# EAGLE design radio_am_4bjt (EAGLE 9.6.2)
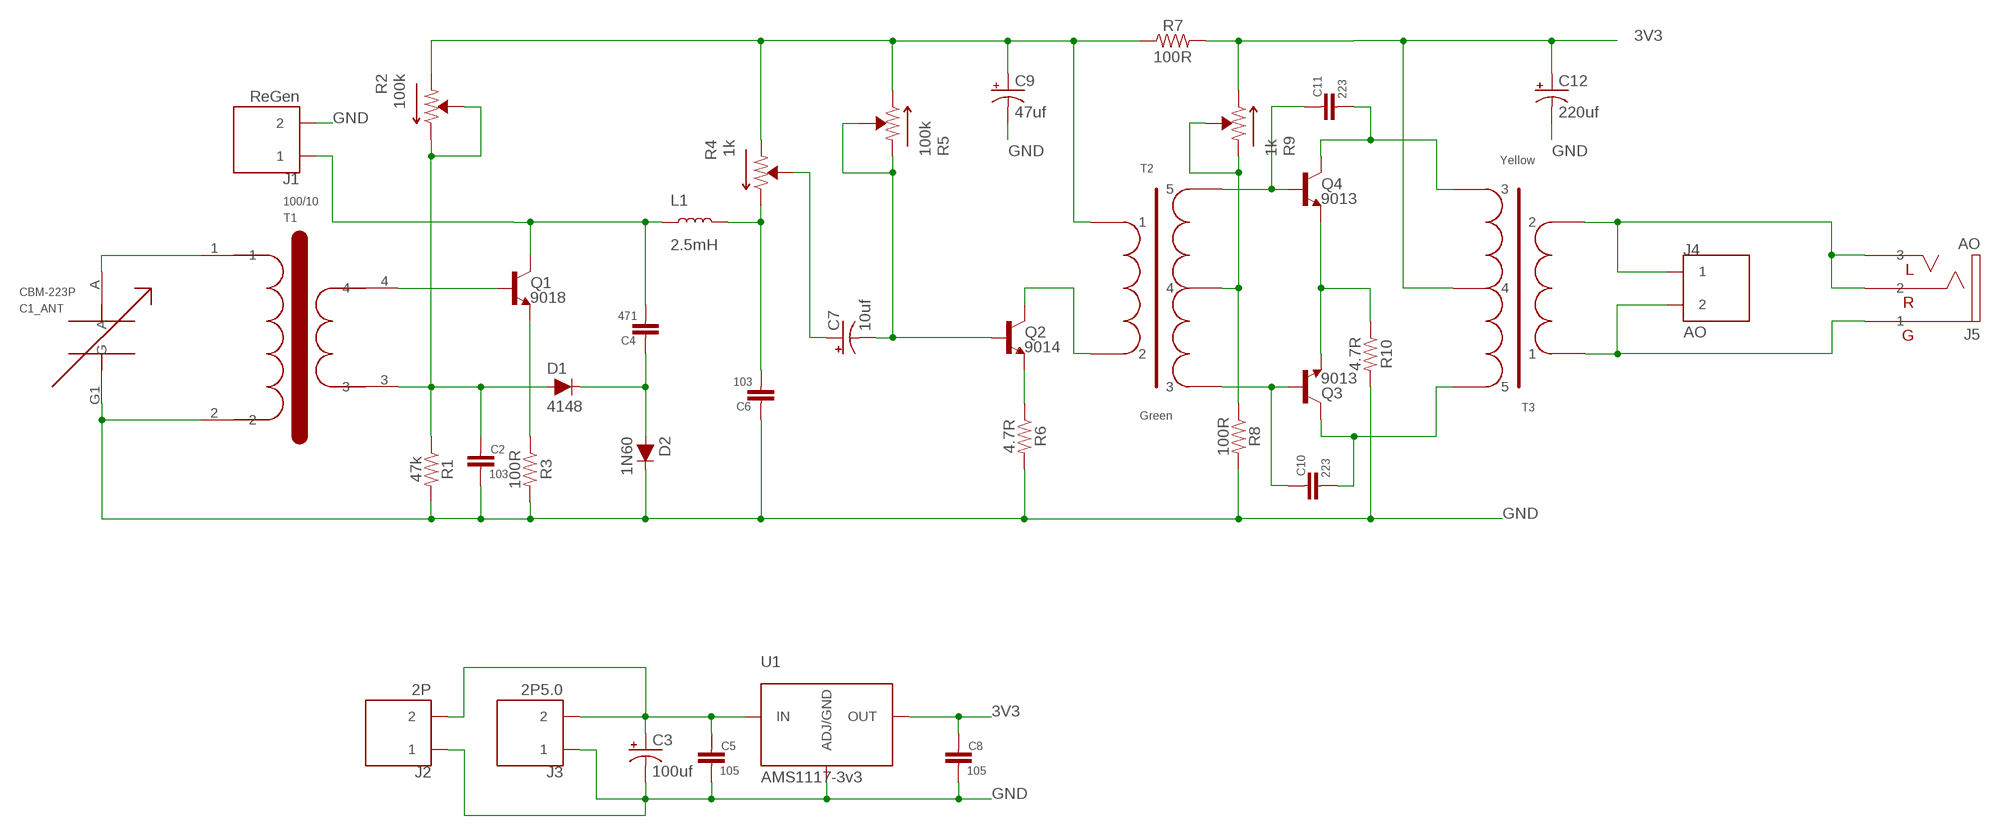
[diagram p0: schematic, sheet 1]

## Parts
C1  CBM-223P  [CBM-223P]
C2  103  CAP_P  [CAP_5MM]
C3  100uf  CAP  [CAP_2.5MM]
C4  471  CAP_P  [CAP_5MM]
C5  105  CAP_P  [CAP_5MM]
C6  103  CAP_P  [CAP_5MM]
C7  10uf  CAP2MM  [CAP_2MM]
C8  105  CAP_P  [CAP_5MM]
C9  47uf  CAP2MM  [CAP_2MM]
C10  223  CAP_P  [CAP_5MM]
C11  223  CAP_P  [CAP_5MM]
C12  220uf  CAP  [CAP_2.5MM]
D1  4148  DIODE-1N4148  [DIODE-1N4148]
D2  1N60  DIODE-1N4148  [DIODE-1N4148]
J1  ReGen  2P  [2P_2.54MM]
J2  2P  [2P_2.54MM]
J3  2P5.0  [2P_5.08MM]
J4  AO  2P5.0  [2P_5.08MM]
J5  AO  3.5MM_PHONE  [3.5MM]
L1  2.5mH  INDUCTOR_PTH  [VLU0810]
Q1  9018  TRANS_NPN-2N3904  [TO-92]
Q2  9014  TRANS_NPN-2N3904  [TO-92]
Q3  9013  TRANS_NPN-2N3904  [TO-92]
Q4  9013  TRANS_NPN-2N3904  [TO-92]
R1  47k  RESISTORAXIAL-0.3  [AXIAL-0.3]
R2  100k  RES_ADJ  [3362P]
R3  100R  RESISTORAXIAL-0.3  [AXIAL-0.3]
R4  1k  RES_ADJ  [3362P]
R5  100k  RES_ADJ  [3362P]
R6  4.7R  RESISTORAXIAL-0.3  [AXIAL-0.3]
R7  100R  RESISTORAXIAL-0.3  [AXIAL-0.3]
R8  100R  RESISTORAXIAL-0.3  [AXIAL-0.3]
R9  1k  RES_ADJ  [3362P]
R10  4.7R  RESISTORAXIAL-0.3  [AXIAL-0.3]
T1  100/10  AM_ANT_COIL  [AM_ANT_COIL]
T2  Green  TRANSFORMER_BJT_PP  [TRANSFORMER_BJT_PP_2_4]
T3  Yellow  TRANSFORMER_BJT_PP  [TRANSFORMER_BJT_PP_2_4]
U1  AMS1117-3v3  AMS1117  [SOT-223]

## Nets
3V3: C8.P$1 C12.+ R7.P$2 R9.P$3 T3.4 U1.2(OUT) U1.4(OUT)
GND: C1.G1(G) C2.P$2 C3.- C5.P$2 C6.P$1 C8.P$2 C9.- C12.- D2.C J1.2 J2.1 J3.L R1.P$2 R3.P$2 R6.P$2 R8.P$2 R10.P$2 T1.2 U1.1(ADJ/GND)
N$1: C1.A T1.1
N$2: Q1.2(B) T1.4
N$3: Q2.1(E) R6.P$1
N$4: C4.P$1 D1.C D2.A
N$5: C4.P$2 J1.1 L1.+ Q1.3(C)
N$6: C7.+ R4.P$2
N$7: C9.+ R2.P$1 R4.P$1 R5.P$3 R7.P$1 T2.1
N$8: C6.P$2 L1.- R4.P$3
N$9: C7.- Q2.2(B) R5.P$1 R5.P$2
N$11: C11.P$2 Q4.3(C) T3.3
N$12: C10.P$2 Q3.3(C) T3.5
N$13: R8.P$1 R9.P$1 R9.P$2 T2.4
N$14: C10.P$1 Q3.2(B) T2.3
N$15: C11.P$1 Q4.2(B) T2.5
N$16: J4.N J5.P$1 T3.1
N$17: J4.L J5.P$2 J5.P$3 T3.2
N$18: C2.P$1 D1.A R1.P$1 R2.P$2 R2.P$3 T1.3
N$19: C3.+ C5.P$1 J2.2 J3.N U1.3(IN)
N$20: Q3.1(E) Q4.1(E) R10.P$1
N$21: Q1.1(E) R3.P$1
N$22: Q2.3(C) T2.2
Unconnected: C1.G2(G) C1.O

## Library data of the parts
C1 = RF:CBM-223P
C2 C4-C6 C8 C10 C11 = Capacitors:CAP_P
C3 C7 C9 C12 = Capacitors:CAP
D1 D2 = PTH:DIODE: Diode These are standard reverse protection diodes and small signal diodes. SparkFun Products: SparkFun SparkPunk Sound Kit <https://www.sparkfun.com/products/11177> SparkFun ESP8266 Thing <https://www.sparkfun.com/products/13231>; PROD_ID: DIO-08378; VALUE: 200mA/100V/1V
J1-J4 = Jumpers:2P
J5 = Connectors:3.5MM_PHONE: 描述： 类型：3.5mm耳机插口 接口：三段式 连接：https://item.szlcsc.com/19296.html
L1 = Coils:INDUCTOR_PTH: 描述： 名称：电感 VLU0810-102K 参数：1000uH ±10% 封装：8*10 链接：https://item.szlcsc.com/73738.html
Q1-Q4 = PTH:TRANS_NPN: NPN transistor Current controlled devices typically used to amplify current or used as a switch. BC547 - COM-08928 <http://www.sparkfun.com/products/8928> (TO-92 45V 100mA) (1.Collector 2.Base 3.Emitter) 2N3904 - COM-00521 <http://www.sparkfun.com/products/521> (TO-92 40V 200mA) (1.Emitter 2.Base 3.Collector) P2N2222A - COM-12852 <http://www.sparkfun.com/products/12852> (TO-92 40V 600mA) (1.Collector 2.Base 3.Emitter); PROD_ID: TRANS-08447; VALUE: 200mA/40V
R1 R3 R6-R8 R10 = PTH:RESISTOR: Generic Resistor Package
R2 R4 R5 R9 = Resistors:RES_ADJ: 描述：可调电阻器 链接：https://item.szlcsc.com/120225.html
T1 = RF:AM_ANT_COIL
T2 T3 = Coils:TRANSFORMER_BJT_PP
U1 = IC_Power:AMS1117

## Board
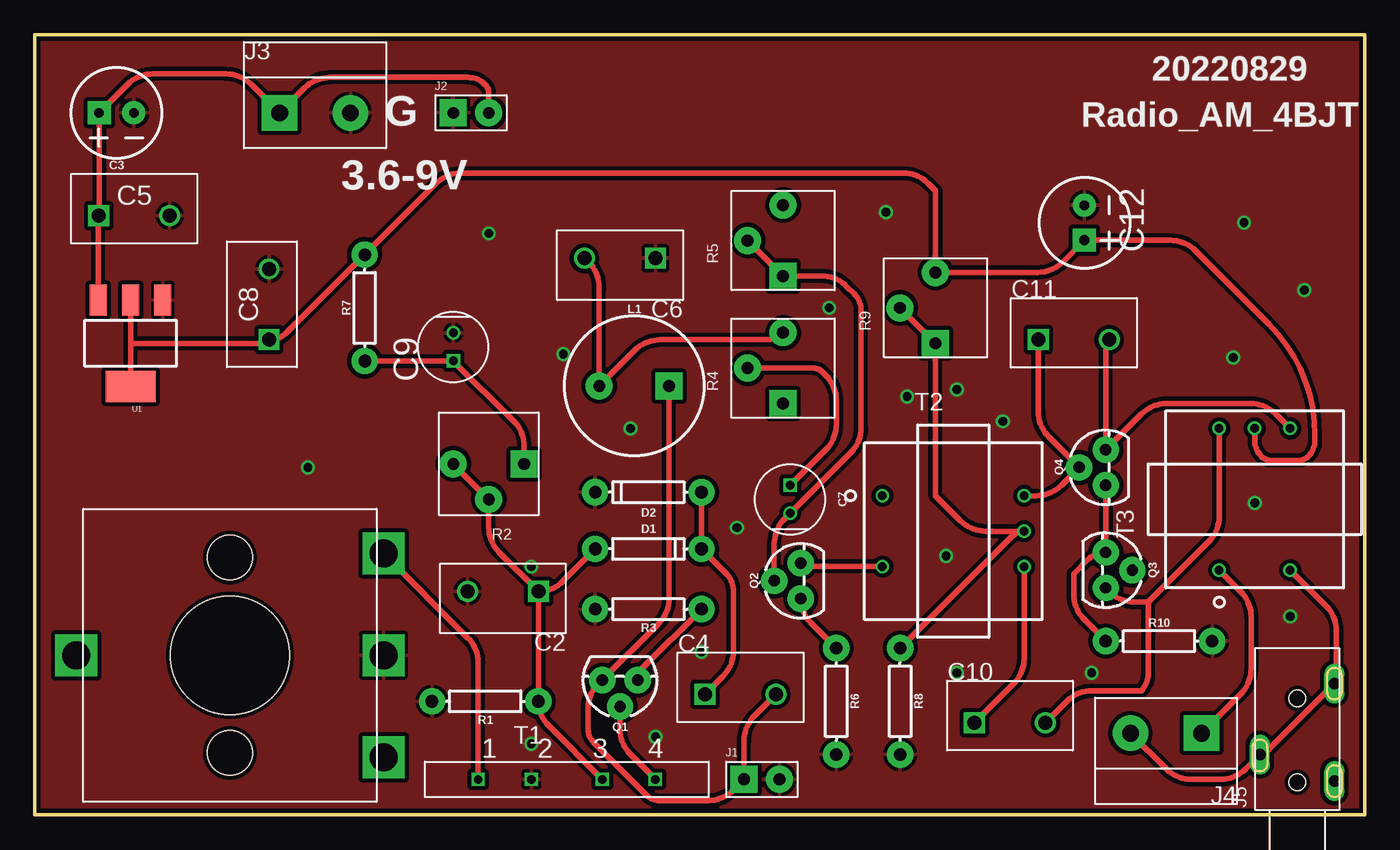
[diagram p1: board, top side]
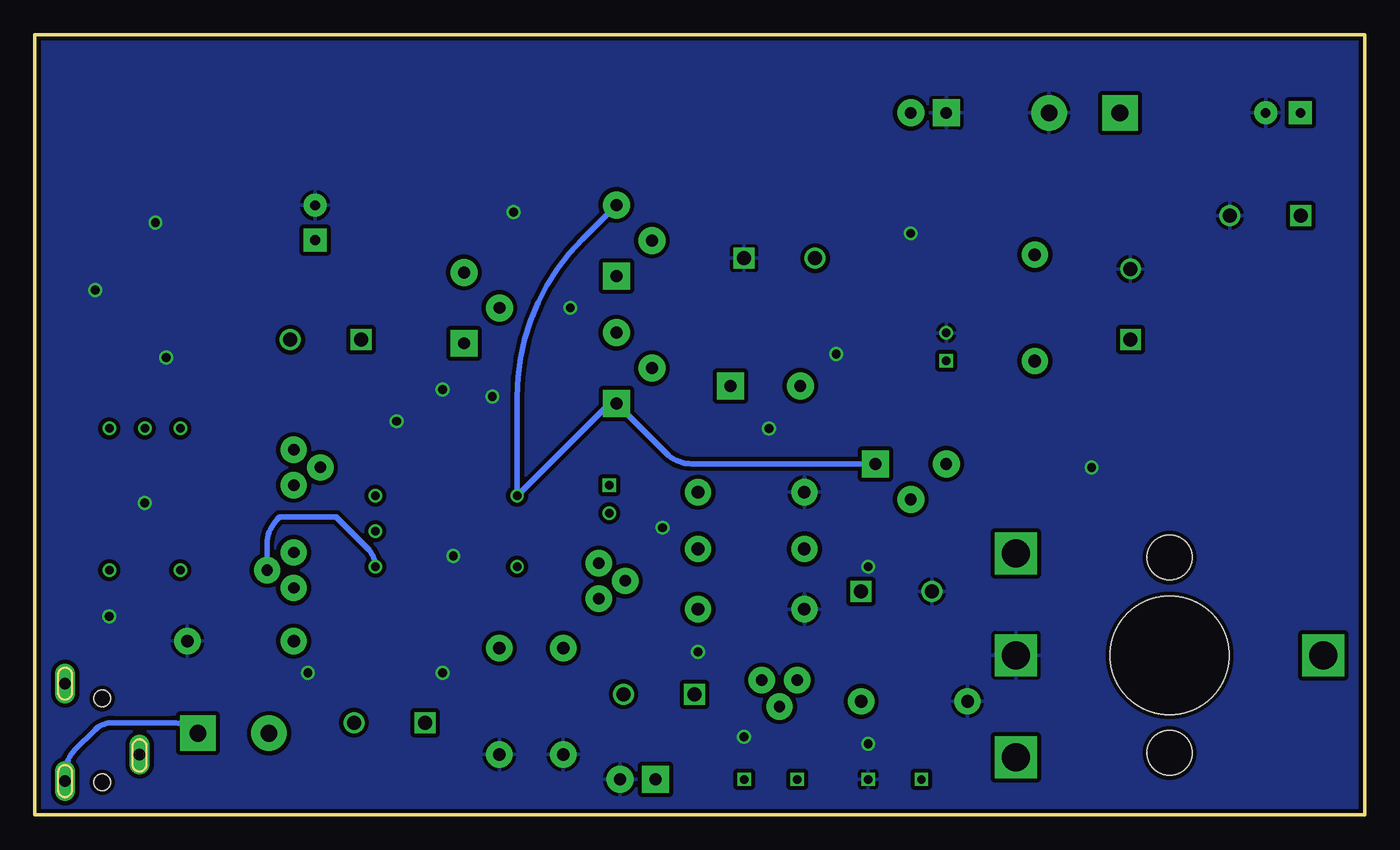
[diagram p2: board, bottom side, seen from below]

Size 95.25 x 55.88 mm. Coordinates in mm from the lower left corner, seen from the top.
Outline: 0,0 0,55.88 95.25,55.88 95.25,0 0,0
Copper layers (1*16): Top 0.035mm / dielectric 1.5mm / Bottom 0.035mm
Design rules "SparkFun-2-Layer-General-JLCPCB": minimum track width 7mil, minimum drill 0.3mm, track to track 7mil, track to pad 7mil, pad to pad 7mil, via to via 7mil, smd to smd 7mil, copper to edge 7mil, drill to drill 7mil, minimum pad ring 7mil, minimum via ring 7mil, stop-mask expansion 3mil, vias tented up to drill 25mil, thermal gap 10mil

### Footprints (pad centres in the part's own frame; a part is rotated, then mirrored left to right if it is on the bottom)
CBM-223P = drill 2 square: A 7.3,-11; G1 0,-11; G2 0,11; O -7.3,-11 | hole 8.5: 0,0 | hole 3.2: -7,0; 7,0
CAP_5MM = drill 1 square: P$1 -2.54,0 | drill 1: P$2 2.54,0
CAP_2.5MM = drill 0.7 pad 1.651 square: + 1.25,0 | drill 0.7 pad 1.651: - -1.25,0
CAP_2MM = drill 0.6 square: + -1,0 | drill 0.6: - 1,0
DIODE-1N4148 = drill 0.9 pad 1.88: A -3.81,0; C 3.81,0
2P_2.54MM = drill 0.85 pad 1.93 square: 1 0,0 | drill 0.85 pad 1.93: 2 2.54,0
2P_5.08MM = drill 1.2 pad 2.54: L 5.08,0 | drill 1.2 pad 2.54 square: N 0,0
3.5MM = drill 0.8 pad 1.422 long: P$1 -2.921,-2.667; P$2 -1.016,2.667; P$3 4.064,-2.667 | hole 1.2: -3,0; 3,0
VLU0810 = drill 0.85 pad 1.93 square: + 2.5,0 | drill 0.85 pad 1.93: - -2.5,0
TO-92 = drill 0.813 pad 1.88: 1 -1.27,0; 2 0,1.905; 3 1.27,0
AXIAL-0.3 = drill 0.9 pad 1.88: P$1 -3.81,0; P$2 3.81,0
3362P = drill 0.85 pad 1.93 square: P$1 -2.54,0 | drill 0.85 pad 1.93: P$2 0,2.54; P$3 2.54,0
AM_ANT_COIL = drill 0.6 square: 1 -6.35,0; 2 -2.54,0; 3 2.54,0; 4 6.35,0
TRANSFORMER_BJT_PP_2_4 = drill 0.6: 1 -5.08,2.54; 2 -5.08,-2.54; 3 5.08,-2.54; 4 5.08,0; 5 5.08,2.54
SOT-223 = smd 2.235 x 1.219: 1 3.099,-2.311; 2 3.099,0; 3 3.099,2.311 | smd 2.2 x 3.6: 4 -3.099,0

### Placement (x,y rotation side)
C1  13.97,11.43 90 top
C2  33.53,16 180 top
C3  5.84,50.29 180 top
C4  50.55,8.64 0 top
C5  7.11,42.93 0 top
C6  41.91,39.88 180 top
C7  54.1,22.61 270 top
C8  16.76,36.58 90 top
C9  29.97,33.53 90 top
C10  69.85,6.6 0 top
C11  74.42,34.04 0 top
C12  75.18,42.42 270 top
D1  43.94,19.05 0 top
D2  43.94,23.11 180 top
J1  50.8,2.54 0 top
J2  29.97,50.29 0 top
J3  17.53,50.29 0 top
J4  83.57,5.84 180 top
J5  90.42,5.33 90 top
L1  42.93,30.73 0 top
Q1  41.91,9.65 180 top
Q2  54.86,16.76 90 top
Q3  76.71,17.53 270 top
Q4  76.71,24.89 90 top
R1  32.26,8.13 180 top
R2  32.51,25.15 180 top
R3  43.94,14.73 180 top
R4  53.59,32 90 top
R5  53.59,41.15 90 top
R6  57.4,8.13 270 top
R7  23.62,36.32 90 top
R8  61.98,8.13 270 top
R9  64.52,36.32 90 top
R10  80.52,12.45 0 top
T1  38.1,2.54 0 top
T2  65.79,20.32 0 top
T3  87.38,22.61 90 top
U1  6.86,33.78 90 top

### Tracks (layer width: path | path; a pad name or v marks a point on that pad's centre or on a via)
3V3
  Top 0.406: U1.4 6.86,33.78 | 6.86,33.78 U1.2 | 6.86,33.78 16.15,33.78 arc45 C8.P$1 arc45 18.07,34.58 R7.P$2 28.72,45.23 arc-45 30.52,45.97 62.23,45.97 arc-45 63.96,45.26 64.52,44.7 R9.P$3 71.83,38.86 arc45 73.62,39.61 C12.+ 81.34,41.17 arc-45 83.14,40.42 88.38,35.18 arc-45 91.69,27.18 91.69,26.88 arc-45 91.19,25.65 arc-45 90.57,25.4 88.5,25.4 arc-45 87.88,25.65 arc-45 87.38,26.88 T3.4
GND  (via drill 0.64)
  other vias: 37.85,33.02 56.9,36.32 62.48,29.97 66.04,30.48 60.96,43.18 86.61,42.42 85.85,32.77 65.28,18.54 87.38,22.35 75.69,10.16 66.04,10.16 47.75,11.68 44.45,5.59 35.56,5.08 35.56,17.78 42.67,27.69 90.93,37.59 89.92,14.22 69.34,28.19 32.51,41.66 19.56,24.89 50.29,20.57
  pour Top (isolate 0.305): 0,0 0,55.88 95.25,55.88 95.25,0
  pour Bottom (isolate 0.305): 0,0 0,55.88 95.25,55.88 95.25,0
N$1
  Top 0.406: T1.1 31.75,10.9 arc45 31.01,12.69 C1.A
N$2
  Top 0.406: T1.4 42.65,4.34 arc-45 41.91,6.13 Q1.2
N$3
  Top 0.406: R6.P$1 55.58,13.76 arc-45 Q2.1
N$4
  Top 0.406: C4.P$1 49.29,9.92 arc45 50.04,11.72 50.04,16 arc45 49.5,17.3 D1.C D2.A
N$5
  Top 0.406: C4.P$2 51.54,7.09 arc45 50.8,5.3 J1.1 50.02,1.76 arc-45 48.22,1.02 44.74,1.02 arc-45 43.81,1.4 40.01,5.2 arc-45 39.62,6.13 39.62,7.62 arc-45 40.34,9.35 Q1.3 44.68,13.69 arc45 45.43,15.49 L1.+
N$6
  Top 0.406: C7.+ 56.66,26.16 arc45 57.4,27.96 57.4,29.72 arc45 56.69,31.45 56.39,31.75 arc45 55.77,32 R4.P$2
N$7
  Top 0.406: R7.P$1 arc-45 23.66,32.53 C9.+ 34.31,28.19 arc-45 35.05,26.4 R2.P$1
  Bottom 0.406: R5.P$3 56.03,41.25 arc-45 60.71,29.96 T2.1 54.46,29.11 arc45 R4.P$1 50.02,25.89 arc-45 48.22,25.15 R2.P$1
N$8
  Top 0.406: C6.P$2 39.68,39.57 arc-45 40.43,37.77 L1.- 42.98,33.29 arc-45 44.78,34.04 52.37,34.04 arc45 R4.P$3
N$9
  Top 0.406: Q2.2 52.96,19.41 arc-45 53.7,21.21 C7.- 58.44,25.94 arc45 59.18,27.74 59.18,36.11 arc45 58.67,37.34 58.15,37.86 arc45 56.35,38.61 R5.P$1 R5.P$2
N$11
  Top 0.406: C11.P$2 arc45 76.71,33.42 Q4.3 79.27,28.72 arc-45 81.06,29.46 87.09,29.46 arc-45 88.88,28.72 T3.3
N$12
  Top 0.406: Q3.3 76.98,15.98 arc45 78.78,15.24 79.76,15.24 | C10.P$2 73.93,8.15 arc-45 75.73,8.89 79.25,8.89 arc45 79.76,10.12 79.76,15.24 | T3.5 84.84,21.37 arc-45 84.09,19.58 79.76,15.24
N$13
  Top 0.406: R9.P$2 R9.P$1 64.52,22.86 66.31,21.06 arc45 68.11,20.32 T2.4 arc45 70,19.96 R8.P$1
N$14
  Top 0.406: C10.P$1 70.12,9.42 arc45 70.87,11.21 T2.3
  Bottom 0.406: Q3.2 78.61,19.39 arc45 77.87,21.19 77.72,21.34 73.66,21.34 71.41,19.08 arc45 T2.3
N$15
  Top 0.406: C11.P$1 71.88,28.86 arc45 72.63,27.07 Q4.2 73.52,23.6 arc-45 71.72,22.86 T2.5
N$16
  Top 0.406: T3.1 86.38,15.98 arc-45 87.12,14.19 87.12,10.45 arc-45 86.38,8.65 J4.N
  Bottom 0.406: J5.P$1 93.09,2.88 arc45 92.35,4.68 90.93,6.1 arc45 89.71,6.6 85.38,6.6 arc45 83.58,5.86 J4.N
N$17
  Top 0.406: J4.L 81.04,3.28 arc45 82.84,2.54 84.93,2.54 arc45 86.72,3.28 J5.P$2 arc45 88.19,4.5 J5.P$3 93.24,9.54 93.24,13.15 arc45 92.49,14.95 T3.2
N$18
  Top 0.406: R2.P$3 R2.P$2 32.51,20.61 arc45 33.26,18.81 C2.P$1 | C2.P$1 R1.P$1 arc45 36.79,6.39 T1.3 | D1.A 37.8,16.72 arc-45 C2.P$1
N$19
  Top 0.406: U1.3 4.55,42.87 arc-45 C5.P$1 arc45 4.59,42.97 C3.+ 6.64,52.34 arc-45 8.44,53.09 13.68,53.09 arc-45 15.48,52.34 J3.N 19.32,52.09 arc-45 21.12,52.83 31.03,52.83 arc-45 32.26,52.32 arc-45 32.51,51.71 J2.2
N$20
  Top 0.406: R10.P$1 75.17,13.99 arc-45 74.42,15.78 74.42,17.27 75.41,18.26 arc-45 Q3.1 Q4.1
N$21
  Top 0.406: Q1.1 arc-45 43.54,10.52 R3.P$1
N$22
  Top 0.406: T2.2 55.48,17.78 arc-45 Q2.3

### Text on the board
tPlace: 20220829 | G | Radio_AM_4BJT | 3.6-9V | 1 2 3 4